# EAGLE schematic adc_guarded_newinput_modular (EAGLE 5.11)
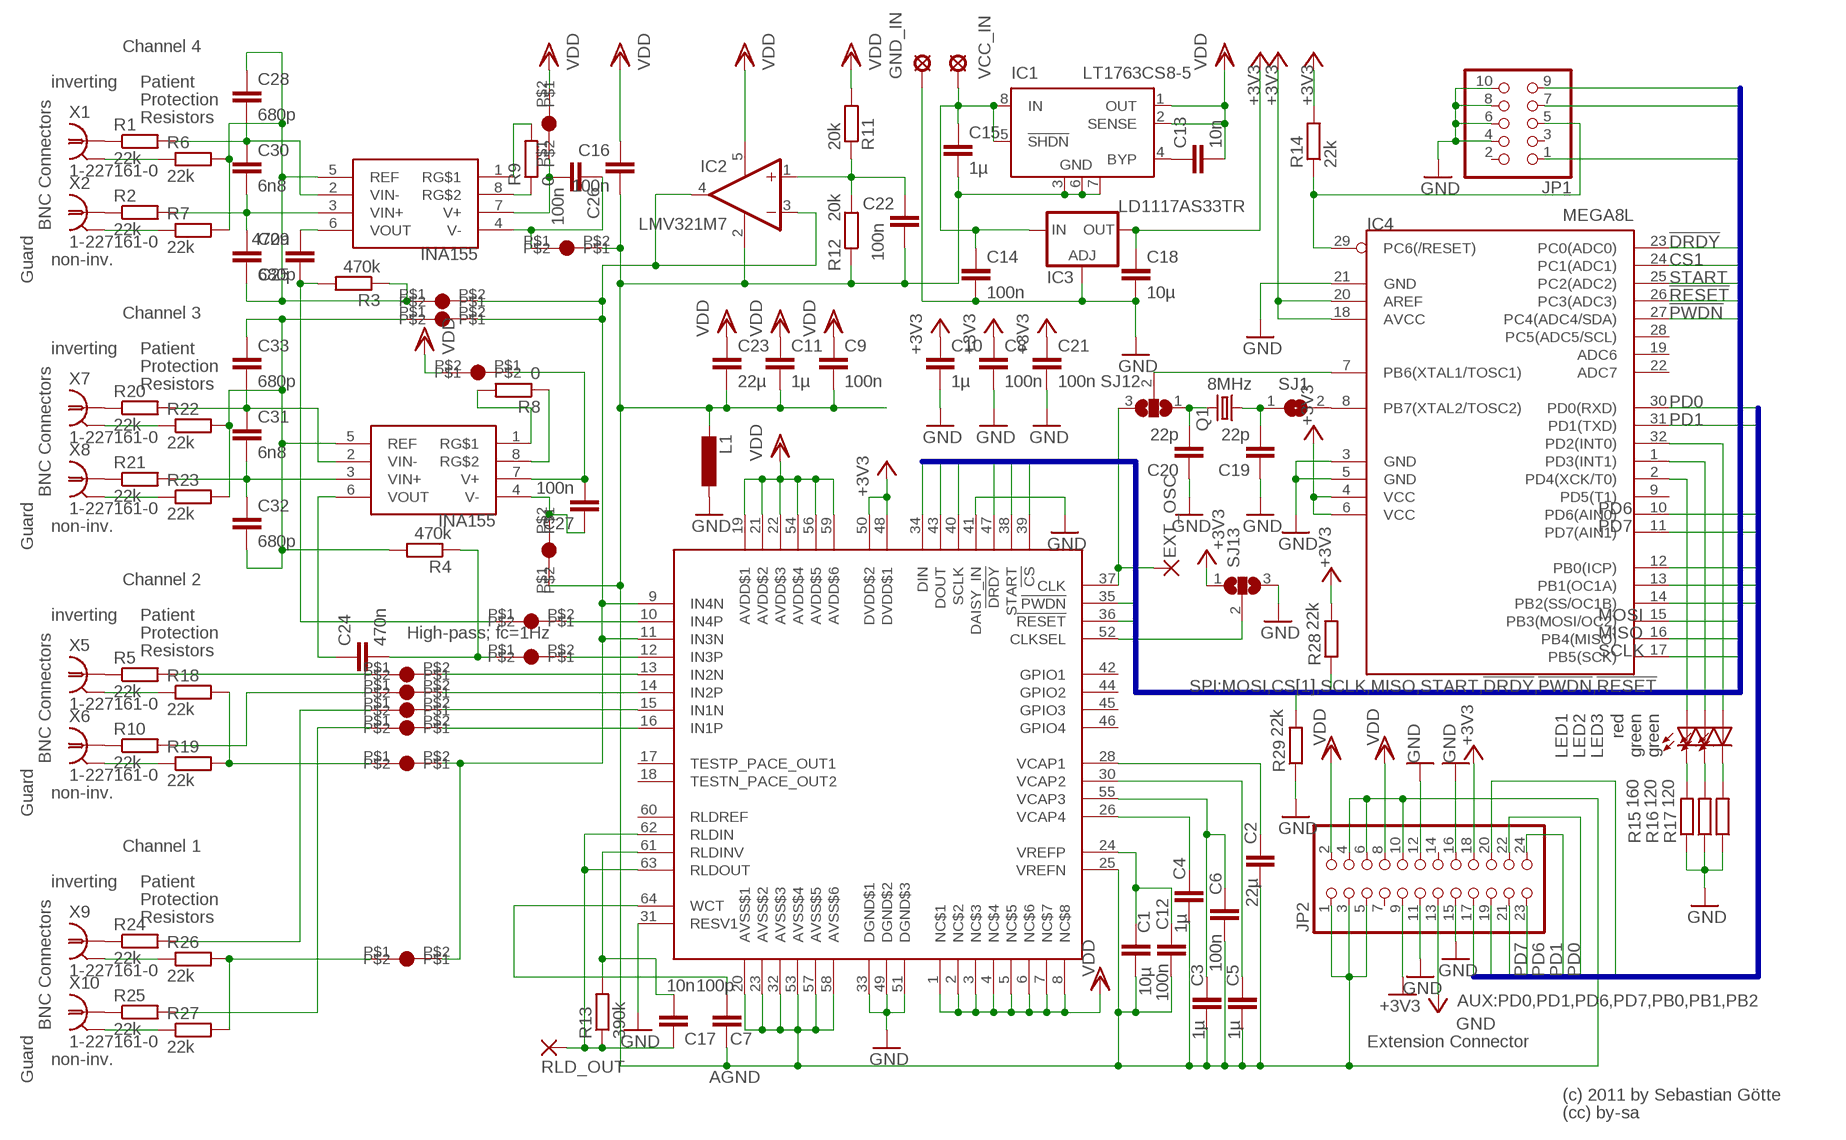
[diagram p0: schematic, sheet 1]

## Parts
C1  10µ  C-EUC0805K  [C0805K]
C2  22µ  C-EUC1206  [C1206]
C3  1µ  C-EUC0805K  [C0805K]
C4  1µ  C-EUC0805K  [C0805K]
C5  1µ  C-EUC0805K  [C0805K]
C6  100n  C-EUC0805K  [C0805K]
C7  100p  C-EUC0805K  [C0805K]
C8  100n  C-EUC0805K  [C0805K]
C9  100n  C-EUC0805K  [C0805K]
C10  1µ  C-EUC0805  [C0805]
C11  1µ  C-EUC0805K  [C0805K]
C12  100n  C-EUC0805K  [C0805K]
C13  10n  C-EUC0805K  [C0805K]
C14  100n  C-EUC0805K  [C0805K]
C15  1µ  C-EUC0805K  [C0805K]
C16  100n  C-EUC0805  [C0805]
C17  10n  C-EUC0805K  [C0805K]
C18  10µ  C-EUC0805K  [C0805K]
C19  22p  C-EUC0805K  [C0805K]
C20  22p  C-EUC0805K  [C0805K]
C21  100n  C-EUC0805K  [C0805K]
C22  100n  C-EUC0805  [C0805]
C23  22µ  C-EUC1206  [C1206]
C24  470n  C-EUC0805K  [C0805K]
C25  470n  C-EUC0805K  [C0805K]
C26  100n  C-EUC0805K  [C0805K]
C27  100n  C-EUC0805K  [C0805K]
C28  680p  C-EUC0805  [C0805]
C29  680p  C-EUC0805  [C0805]
C30  6n8  C-EUC0805  [C0805]
C31  6n8  C-EUC0805  [C0805]
C32  680p  C-EUC0805  [C0805]
C33  680p  C-EUC0805  [C0805]
EXT_OSC  1,6/0,8  [1,6/0,8]
GND_IN  MCS10B  [MCS10B]
IC1  LT1763CS8-5  LT1763CS8-3.3  [SOIC8]
IC2  LMV321M7  [SC70-5L]
IC3  LD1117AS33TR  LD117AS33TR  [SOT223]
IC4  MEGA8L  MEGA8-AI  [TQFP32-08]
JP1  PINHD-2X5  [2X05]
JP2  PINHD-2X12  [2X12]
L1  L-EUPIS2816  [PIS2816]
LED1  red  LEDCHIPLED_1206  [CHIPLED_1206]
LED2  green  LEDCHIPLED_1206  [CHIPLED_1206]
LED3  green  LEDCHIPLED_1206  [CHIPLED_1206]
Q1  8MHz  CRYSTALHC49UP  [HC49UP]
R1  22k  R-EU_R1206  [R1206]
R2  22k  R-EU_R1206  [R1206]
R3  470k  R-EU_R1206  [R1206]
R4  470k  R-EU_R1206  [R1206]
R5  22k  R-EU_R1206  [R1206]
R6  22k  R-EU_R1206  [R1206]
R7  22k  R-EU_R1206  [R1206]
R8  0  R-EU_R1206  [R1206]
R9  0  R-EU_R1206  [R1206]
R10  22k  R-EU_R1206  [R1206]
R11  20k  R-EU_R1206  [R1206]
R12  20k  R-EU_R1206  [R1206]
R13  390k  R-EU_R1206  [R1206]
R14  22k  R-EU_R1206  [R1206]
R15  160  R-EU_R1206  [R1206]
R16  120  R-EU_R1206  [R1206]
R17  120  R-EU_R1206  [R1206]
R18  22k  R-EU_R1206  [R1206]
R19  22k  R-EU_R1206  [R1206]
R20  22k  R-EU_R1206  [R1206]
R21  22k  R-EU_R1206  [R1206]
R22  22k  R-EU_R1206  [R1206]
R23  22k  R-EU_R1206  [R1206]
R24  22k  R-EU_R1206  [R1206]
R25  22k  R-EU_R1206  [R1206]
R26  22k  R-EU_R1206  [R1206]
R27  22k  R-EU_R1206  [R1206]
R28  22k  R-EU_R1206  [R1206]
R29  22k  R-EU_R1206  [R1206]
RLD_OUT  2,54/1,0  [2,54/1,0]
SJ1  SJ  [SJ]
SJ12  SJ2W  [SJ_2]
SJ13  SJ2W  [SJ_2]
U$1  ADS1194  [TQFP-64]
U$2  INA155  [SO-08]
U$3  INA155  [SO-08]
U$4  DOUBLE_PAD  [DOUBLE_PAD]
U$5  DOUBLE_PAD  [DOUBLE_PAD]
U$6  DOUBLE_PAD  [DOUBLE_PAD]
U$7  DOUBLE_PAD  [DOUBLE_PAD]
U$8  DOUBLE_PAD  [DOUBLE_PAD]
U$9  DOUBLE_PAD  [DOUBLE_PAD]
U$10  DOUBLE_PAD  [DOUBLE_PAD]
U$11  DOUBLE_PAD  [DOUBLE_PAD]
U$12  DOUBLE_PAD  [DOUBLE_PAD]
U$13  DOUBLE_PAD  [DOUBLE_PAD]
U$14  DOUBLE_PAD  [DOUBLE_PAD]
U$15  DOUBLE_PAD  [DOUBLE_PAD]
U$16  DOUBLE_PAD  [DOUBLE_PAD]
U$17  DOUBLE_PAD  [DOUBLE_PAD]
VCC_IN  MCS10B  [MCS10B]
X1  1-227161-0  [AMP_227161]
X2  1-227161-0  [AMP_227161]
X5  1-227161-0  [AMP_227161]
X6  1-227161-0  [AMP_227161]
X7  1-227161-0  [AMP_227161]
X8  1-227161-0  [AMP_227161]
X9  1-227161-0  [AMP_227161]
X10  1-227161-0  [AMP_227161]

## Nets
!DRDY: IC4.23(PC0(ADC0)) U$1.47(!DRDY)
!PWDN: IC4.27(PC4(ADC4/SDA)) U$1.35(!PWDN)
!RESET: IC4.26(PC3(ADC3)) R29.2 U$1.36(!RESET)
+3V3: C8.1 C10.1 C18.1 C21.1 IC3.4(OUT) IC4.4(VCC) IC4.6(VCC) IC4.18(AVCC) IC4.20(AREF) JP2.13 JP2.18 R14.2 R28.2 SJ13.1 U$1.48(DVDD$1) U$1.50(DVDD$2)
AGND: C1.2 C2.2 C3.2 C4.2 C5.2 C6.2 C7.1 C9.2 C11.2 C12.2 C15.2 C16.2 C22.2 C23.2 IC1.3(GND) IC1.6(GND) IC1.7(GND) IC2.2(V-) JP2.1 JP2.3 JP2.4 JP2.5 JP2.6 JP2.10 L1.2 R12.1 U$1.20(AVSS$1) U$1.23(AVSS$2) U$1.25(VREFN) U$1.32(AVSS$3) U$1.53(AVSS$4) U$1.57(AVSS$5) U$1.58(AVSS$6) U$4.P$2 U$15.P$1
CLK: EXT_OSC.1(P) SJ12.3 U$1.37(CLK)
CLKSEL: SJ13.2 U$1.52(CLKSEL)
CS1: IC4.24(PC1(ADC1)) R28.1 U$1.39(!CS)
GND: C8.2 C10.2 C14.2 C18.2 C19.1 C20.1 C21.2 GND_IN.MP IC3.1(ADJ) IC4.3(GND) IC4.5(GND) IC4.21(GND) JP1.4 JP1.6 JP1.8 JP1.10 JP2.9 JP2.11 JP2.12 JP2.15 JP2.16 L1.1 R15.1 R16.1 R17.1 R29.1 SJ13.3 U$1.31(RESV1) U$1.33(DGND$1) U$1.41(DAISY_IN) U$1.49(DGND$2) U$1.51(DGND$3)
MISO: IC4.16(PB4(MISO)) JP1.9 U$1.43(DOUT)
MOSI: IC4.15(PB3(MOSI/OC2)) JP1.1 U$1.34(DIN)
N$1: C2.1 U$1.28(VCAP1)
N$2: C4.1 U$1.26(VCAP4)
N$3: C7.2 U$1.64(WCT)
N$4: C5.1 U$1.30(VCAP2)
N$5: C3.1 C6.1 U$1.55(VCAP3)
N$6: C1.1 C12.1 U$1.24(VREFP)
N$7: R9.1 U$2.8(RG$2)
N$8: IC2.3(-IN) IC2.4(OUT) U$1.9(IN4N) U$1.11(IN3N) U$5.P$2 U$6.P$2 U$7.P$2 U$8.P$2
N$9: C25.1 R3.2 U$14.P$1
N$10: C28.1 C29.2 R3.1 R6.2 R7.2 U$2.5(REF) U$5.P$1
N$11: R5.2 U$12.P$1
N$12: C29.1 C30.2 R2.2 U$2.3(VIN+)
N$13: C28.2 C30.1 R1.2 U$2.2(VIN-)
N$14: R5.1 X5.1
N$15: R10.1 X6.1
N$16: C13.1 IC1.4(BYP)
N$17: R1.1 X1.1
N$18: R2.1 X2.1
N$19: R9.2 U$2.1(RG$1)
N$20: R8.1 U$3.8(RG$2)
N$21: R19.1 X6.2(GND)
N$22: R18.1 X5.2(GND)
N$23: R20.1 X7.1
N$24: R10.2 U$11.P$1
N$25: R8.2 U$3.1(RG$1)
N$26: C24.1 U$3.6(VOUT)
N$27: R21.1 X8.1
N$28: C31.1 C33.2 R20.2 U$3.2(VIN-)
N$29: C31.2 C32.1 R21.2 U$3.3(VIN+)
N$30: R7.1 X2.2(GND)
N$31: R6.1 X1.2(GND)
N$32: C24.2 R4.1 U$13.P$1
N$33: C27.2 U$3.7(V+) U$16.P$1
N$34: C17.2 R13.2 U$1.61(RLDINV)
N$35: C20.2 Q1.2 SJ12.1
N$36: R24.2 U$10.P$1
N$37: R25.2 U$9.P$1
N$38: C19.2 Q1.1 SJ1.1
N$39: R26.2 R27.2 U$8.P$1
N$40: IC4.7(PB6(XTAL1/TOSC1)) SJ12.2
N$41: IC4.32(PD2(INT0)) LED3.A
N$42: IC4.1(PD3(INT1)) LED2.A
N$43: IC4.2(PD4(XCK/T0)) LED1.A
N$44: LED1.C R15.2
N$45: LED2.C R16.2
N$46: LED3.C R17.2
N$47: C26.1 U$2.4(V-) U$4.P$1
N$48: IC4.8(PB7(XTAL2/TOSC2)) SJ1.2
N$49: R18.2 R19.2 U$7.P$1
N$50: U$1.16(IN1P) U$9.P$2
N$51: C32.2 C33.1 R4.2 R22.2 R23.2 U$3.5(REF) U$6.P$1
N$52: U$1.15(IN1N) U$10.P$2
N$53: U$1.14(IN2P) U$11.P$2
N$54: U$1.13(IN2N) U$12.P$2
N$55: U$1.12(IN3P) U$13.P$2
N$56: U$1.10(IN4P) U$14.P$2
N$57: C25.2 U$2.6(VOUT)
N$58: R23.1 X8.2(GND)
N$59: R22.1 X7.2(GND)
N$61: C27.1 U$3.4(V-) U$15.P$2
N$62: C26.2 U$2.7(V+) U$17.P$1
N$63: R24.1 X9.1
N$64: R25.1 X10.1
N$65: R27.1 X10.2(GND)
N$66: R26.1 X9.2(GND)
PB0: IC4.12(PB0(ICP)) JP2.20
PB1: IC4.13(PB1(OC1A)) JP2.19
PB2: IC4.14(PB2(SS/OC1B)) JP2.17
PD0: IC4.30(PD0(RXD)) JP2.22
PD1: IC4.31(PD1(TXD)) JP2.24
PD6: IC4.10(PD6(AIN0)) JP2.23
PD7: IC4.11(PD7(AIN1)) JP2.21
REF_NODE: C22.1 IC2.1(+IN) R11.1 R12.2
RLD_OUT: C17.1 R13.1 RLD_OUT.1(P) U$1.62(RLDIN) U$1.63(RLDOUT)
SCLK: IC4.17(PB5(SCK)) JP1.7 U$1.40(SCLK)
START: IC4.25(PC2(ADC2)) U$1.38(START)
UCRESET: IC4.29(PC6(/RESET)) JP1.5 R14.1
VCC_IN: C14.1 C15.1 IC1.5(!SHDN) IC1.8(IN) IC3.3(IN) VCC_IN.MP
VDD: C9.1 C11.1 C13.2 C16.1 C23.1 IC1.1(OUT) IC1.2(SENSE) IC2.5(V+) JP2.2 JP2.8 R11.2 U$1.1(NC$1) U$1.2(NC$2) U$1.3(NC$3) U$1.4(NC$4) U$1.5(NC$5) U$1.6(NC$6) U$1.7(NC$7) U$1.8(NC$8) U$1.19(AVDD$1) U$1.21(AVDD$2) U$1.22(AVDD$3) U$1.54(AVDD$4) U$1.56(AVDD$5) U$1.59(AVDD$6) U$16.P$2 U$17.P$2
Unconnected: IC4.9(PD5(T1)) IC4.19(ADC6) IC4.22(ADC7) IC4.28(PC5(ADC5/SCL)) JP1.2 JP1.3 JP2.7 JP2.14 U$1.17(TESTP_PACE_OUT1) U$1.18(TESTN_PACE_OUT2) U$1.42(GPIO1) U$1.44(GPIO2) U$1.45(GPIO3) U$1.46(GPIO4) U$1.60(RLDREF)

## Buses
SPI:MOSI,CS[1],SCLK,MISO,START,!DRDY,!PWDN,!RESET
AUX:PD0,PD1,PD6,PD7,PB0,PB1,PB2

## Notes on the sheet
- Channel 4
- inverting | Patient
- Protection
- Resistors
- BNC Connectors
- INA155
- non-inv.
- Guard
- Channel 3
- inverting | Patient
- Protection
- Resistors
- BNC Connectors
- INA155
- non-inv.
- Guard
- Channel 2
- inverting | Patient
- Protection | High-pass; fc=1Hz
- Resistors
- BNC Connectors
- non-inv.
- Guard
- Channel 1
- inverting | Patient
- Protection
- Resistors
- BNC Connectors
- Extension Connector
- non-inv.
- Guard | AGND
- (c) 2011 by Sebastian Götte
- (cc) by-sa

## Library data of the parts
C1-C33 = rcl:C-EU: CAPACITOR, European symbol
EXT_OSC = wirepad:1,6/0,8: THROUGH-HOLE PAD
GND_IN VCC_IN = solpad:MCS10B: SOLDER PAD MC S1, distributor Buerklin, 15F505
IC1 = linear-technology:LT1763CS8: 500mA, Low Noise, LDO Micropower Regulators Source: http://cds.linear.com/docs/Datasheet/1763ff.pdf; MPN: LT1763CS8-3.3; OC_FARNELL: 1273617; OC_NEWARK: 57M6055
IC2 = linear:LMV321?*: General Purpose, Low Voltage, Rail-to-Rail Output Operational Amplifiers Source: http://www.national.com/mpf/LM/LMV321.html http://www.national.com/dt/lmv_qual.pdf
IC3 = v-reg:LD117A?*: Low drop fixed and adjustable positive voltage regulators 1 A Source: http://www.st.com/stonline/products/literature/ds/7194/ld1117axx.pdf
IC4 = atmel:MEGA8: MICROCONTROLLER 8 Kbytes FLASH, 1 kbytes SRAM, 512 bytes EEPROM, USART, 6-channel 10 bit ADC, 2-channel 8 bit ADC Pin compatible with Atmega48, ATMega88, ATMega168 Source: avr.lbr; MPN: ATMEGA8-16AU; OC_FARNELL: 9171371; OC_NEWARK: 73M8863
JP1 = pinhead:PINHD-2X5: PIN HEADER
JP2 = pinhead:PINHD-2X12: PIN HEADER
L1 = rcl:L-EU: INDUCTOR, European symbol
LED1-LED3 = led:LED: LED OSRAM: - CHIPLED LG R971, LG N971, LY N971, LG Q971, LY Q971, LO R971, LY R971 LH N974, LH R974 LS Q976, LO Q976, LY Q976 LO Q996 - Hyper CHIPLED LW Q18S LB Q993, LB Q99A, LB R99A - SideLED LS A670, LO A670, LY A670, LG A670, LP A670 LB A673, LV A673, LT A673, LW A673 LH A674 LY A675 LS A676, LA A676, LO A676, LY A676, LW A676 LS A679, LY A679, LG A679 - Hyper Micro SIDELED® LS Y876, LA Y876, LO Y876, LY Y876 LT Y87S - SmartLED LW L88C, LW L88S LB L89C, LB L89S, LG L890 LS L89K, LO L89K, LY L89K LS L896, LA L896, LO L896, LY L896 - TOPLED LS T670, LO T670, LY T670, LG T670, LP T670 LSG T670, LSP T670, LSY T670, LOP T670, LYG T670 LG T671, LOG T671, LSG T671 LB T673, LV T673, LT T673, LW T673 LH T674 LS T676, LA T676, LO T676, LY T676, LB T676, LH T676, LSB T676, LW T676 LB T67C, LV T67C, LT T67C, LS T67K, LO T67K, LY T67K, LW E67C LS E67B, LA E67B, LO E67B, LY E67B, LB E67C, LV E67C, LT E67C LW T67C LS T679, LY T679, LG T679 LS T770, LO T770, LY T770, LG T770, LP T770 LB T773, LV T773, LT T773, LW T773 LH T774 LS E675, LA E675, LY E675, LS T675 LS T776, LA T776, LO T776, LY T776, LB T776 LHGB T686 LT T68C, LB T68C - Hyper Mini TOPLED® LB M676 - Mini TOPLED Santana® LG M470 LS M47K, LO M47K, LY M47K Source: http://www.osram.convergy.de LUXEON: - LUMILED® LXK2-PW12-R00, LXK2-PW12-S00, LXK2-PW14-U00, LXK2-PW14-V00 LXK2-PM12-R00, LXK2-PM12-S00, LXK2-PM14-U00 LXK2-PE12-Q00, LXK2-PE12-R00, LXK2-PE12-S00, LXK2-PE14-T00, LXK2-PE14-U00 LXK2-PB12-K00, LXK2-PB12-L00, LXK2-PB12-M00, LXK2-PB14-N00, LXK2-PB14-P00, LXK2-PB14-Q00 LXK2-PR12-L00, LXK2-PR12-M00, LXK2-PR14-Q00, LXK2-PR14-R00 LXK2-PD12-Q00, LXK2-PD12-R00, LXK2-PD12-S00 LXK2-PH12-R00, LXK2-PH12-S00 LXK2-PL12-P00, LXK2-PL12-Q00, LXK2-PL12-R00 Source: www.luxeon.com KINGBRIGHT: KA-3528ASYC Source: www.kingbright.com
Q1 = crystal:CRYSTAL: CRYSTAL; OC_FARNELL: unknown; OC_NEWARK: unknown
R1-R29 = rcl:R-EU_: RESISTOR, European symbol
RLD_OUT = wirepad:2,54/1,0: THROUGH-HOLE PAD
SJ1 = jumper:SJ: SMD solder JUMPER
SJ12 SJ13 = jumper:SJ2W: SMD solder JUMPER
U$1 = mytexas:ADS1194: Low-Power, 8-Channel, 16-Bit Analog Front-End for Biopotential Measurements for ECG/EEG applications
U$2 U$3 = mytexas:INA155: Single-Supply, Rail-to-Rail Output, CMOS INSTRUMENTATION AMPLIFIER
U$4-U$17 = myparts:DOUBLE_PAD
X1 X2 X5-X10 = con-coax:?227161*: JACK, RIGHT ANGLE, 50 OHM, PCB, BNC Source: amp_227161.pdf; MF: TYCO ELECTRONICS; MPN: 1-227161; OC_FARNELL: unknown; OC_NEWARK: 33B3200